# Altium schematic sheet MCU.SchDoc
size A4; SheetNumber: 1; SheetTotal: 4
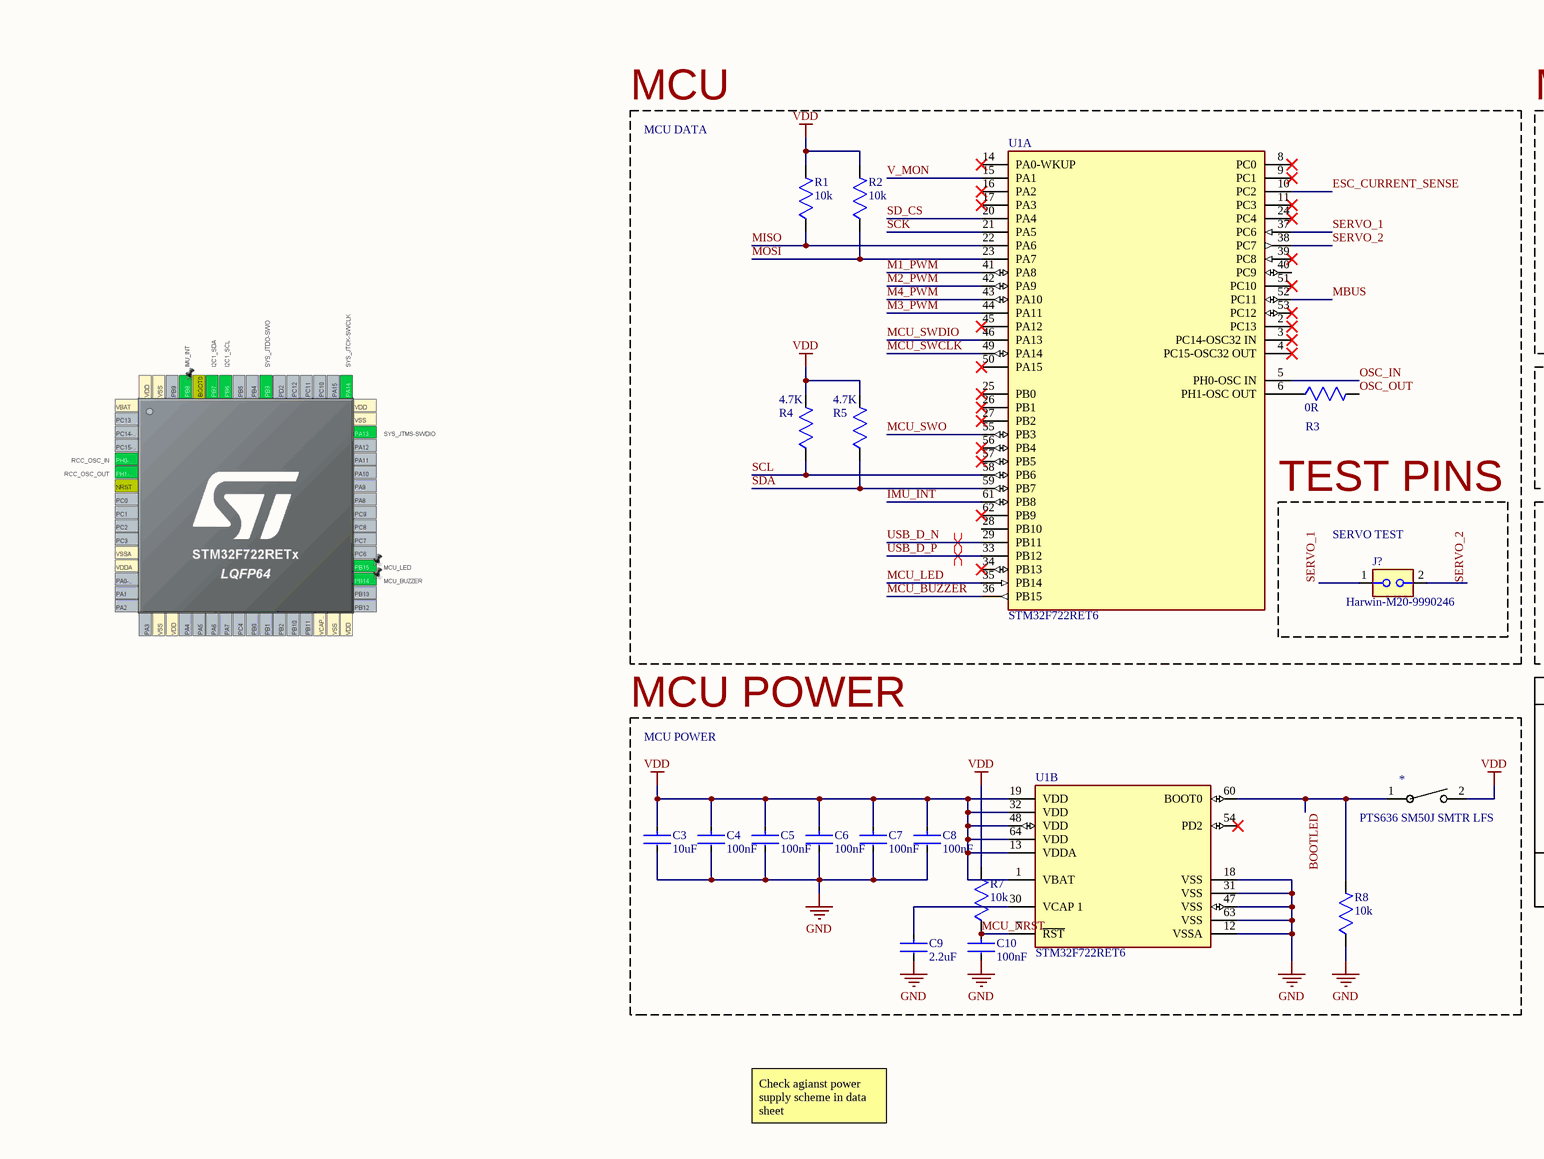
[diagram p0: MCU.SchDoc, left]
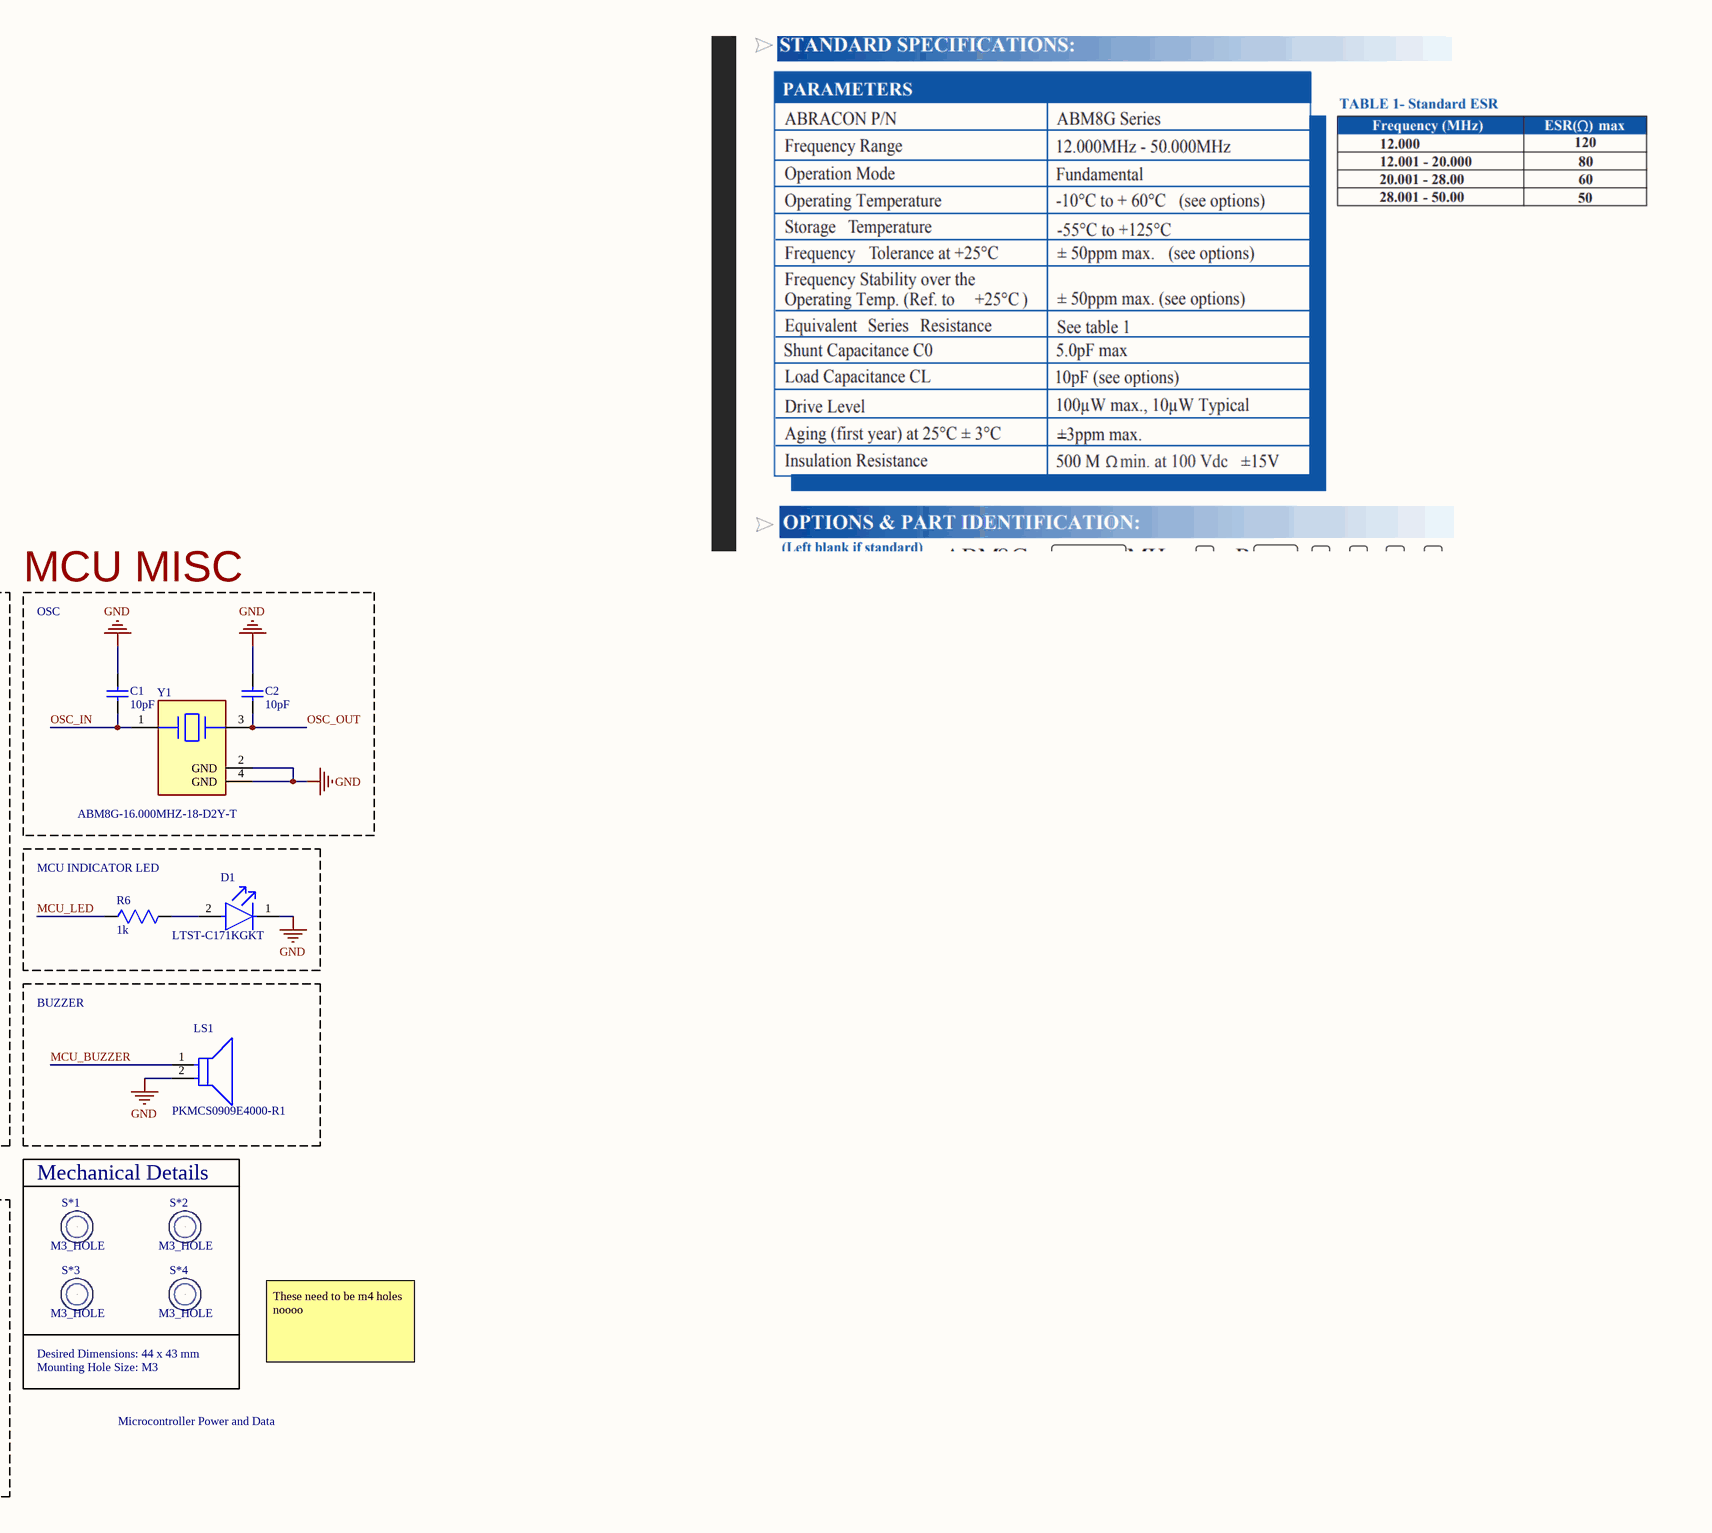
[diagram p1: MCU.SchDoc, right]

## Parts
*  PTS636 SM50J SMTR LFS  [PTS636 SM50J SMTR LFS-Footprint-1]
C1  10pF  [CAPC1005X55X25ML05T05]
C2  10pF  [CAPC1005X55X25ML05T05]
C3  10uF  [CAP_1210]
C4  100nF  [CAP_0603]
C5  100nF  [CAP_0603]
C6  100nF  [CAP_0603]
C7  100nF  [CAP_0603]
C8  100nF  [CAP_0603]
C9  2.2uF  [CAP_1210]
C10  100nF  [CAP_0603]
D1  LTST-C171KGKT  [FP-LTST-C171KGKT-MFG]
J?  Harwin-M20-9990246  [HARWIN_M20-9990246]
LS1  PKMCS0909E4000-R1  [FP-PKMCS-MFG]
R1  10k  [RES_0603]
R2  10k  [RES_0603]
R3  0R  [RES_0603]
R4  4.7K  [RES_0603]
R5  4.7K  [RES_0603]
R6  1k  [RES_0603]
R7  10k  [RES_0603]
R8  10k  [RES_0603]
S*1  M3_HOLE  [M3 Screw Hole Footprint]
S*2  M3_HOLE  [M3 Screw Hole Footprint]
S*3  M3_HOLE  [M3 Screw Hole Footprint]
S*4  M3_HOLE  [M3 Screw Hole Footprint]
U1  STM32F722RET6  [FP-LQFP64-5W-IPC_A]  (parts A,B of 2)
Y1  ABM8G-16.000MHZ-18-D2Y-T  [FP-ABM8G-MFG]

## Blocks framed on the sheet
MCU: R1-R5 U1
MCU MISC: C1 C2 Y1
MCU INDICATOR LED: D1 R6
TEST PINS: J?
BUZZER: LS1
MCU POWER: * C3-C10 R7 R8 U1

## Nets
GND: C1.2 C2.2 C3.2 C4.2 C5.2 C6.2 C7.2 C8.2 C9.2 C10.2 D1.1(C) LS1.2(A) R8.1 U1.12(VSSA) U1.18(VSS) U1.31(VSS) U1.47(VSS) U1.63(VSS) Y1.2(GND) Y1.4(GND)
VDD: *.2 C3.1 C4.1 C5.1 C6.1 C7.1 C8.1 R1.2 R2.2 R4.2 R5.2 R7.2 U1.1(VBAT) U1.13(VDDA) U1.19(VDD) U1.32(VDD) U1.48(VDD) U1.64(VDD)
BOOTLED: *.1 R8.2 U1.60(BOOT0)
ESC_CURRENT_SENSE: U1.10(PC2)
IMU_INT: U1.61(PB8)
M1_PWM: U1.41(PA8)
M2_PWM: U1.42(PA9)
M3_PWM: U1.44(PA11)
M4_PWM: U1.43(PA10)
MBUS: U1.52(PC11)
MCU_BUZZER: LS1.1(C) U1.36(PB15)
MCU_LED: R6.1 U1.35(PB14)
MCU_NRST: C10.1 R7.1 U1.7(~{RST})
MCU_SWCLK: U1.49(PA14)
MCU_SWDIO: U1.46(PA13)
MCU_SWO: U1.55(PB3)
MISO: R1.1 U1.22(PA6)
MOSI: R2.1 U1.23(PA7)
OSC_IN: C1.1 U1.5(PH0-OSC_IN) Y1.1
OSC_OUT: C2.1 R3.2 Y1.3
SCK: U1.21(PA5)
SCL: R4.1 U1.58(PB6)
SD_CS: U1.20(PA4)
SDA: R5.1 U1.59(PB7)
SERVO_1: J?.1 U1.37(PC6)
SERVO_2: J?.2 U1.38(PC7)
USB_D_N: U1.29(PB11)
USB_D_P: U1.33(PB12)
V_MON: U1.15(PA1)
NetC9_1: C9.1 U1.30(VCAP_1)
NetD1_2: D1.2(A) R6.2
NetR3_1: R3.1 U1.6(PH1-OSC_OUT)

Not connected (* = marked no-connect by the designer): S*1 0; S*2 0; S*3 0; S*4 0; U1 2(PC13)* 3(PC14-OSC32_IN)* 4(PC15-OSC32_OUT)* 8(PC0)* 9(PC1)* 11(PC3)* 14(PA0-WKUP)* 16(PA2)* 17(PA3)* 24(PC4)* 25(PB0)* 26(PB1)* 27(PB2)* 28(PB10) 34(PB13)* 39(PC8)* 40(PC9) 45(PA12)* 50(PA15)* 51(PC10)* 53(PC12)* 54(PD2)* 56(PB4)* 57(PB5)* 62(PB9)*

## Layout directives
differential pair: USB_D_N, USB_D_P

## Notes on the sheet
- MCU DATA
- OSC
- (near J?) SERVO TEST
- MCU POWER
- Mechanical Details
- Desired Dimensions: 44 x 43 mm
- These need to be m4 holes noooo
- Mounting Hole Size: M3
- Microcontroller Power and Data
- Check agianst power supply scheme in data sheet

## Library data of the parts
* = CMP-00098-1: Switch Tactile N.O. SPST Rectangular Button J-Bend 0.05A 12VDC 1.77N SMD T/R; Number of Positions: 1; Operating Force: 2.26N; Electrical Life: 50kcycles; Max Voltage Rating (DC): 12V; Max Current Rating: 50mA; Insulation Resistance: 100MΩ; Sealable: IP40; Length: 6mm; Lifecycle Status: Production; Throw Configuration: SPST; Min Operating Temperature: -40°C; Max Operating Temperature: 90°C; RoHS: Compliant; Height: 3.25mm; REACH SVHC: Yes; Contact Resistance: 100mΩ; Color: Black
C1 C2 = CMP-2100-03589-1: Chip Capacitor, 10 pF, +/- 5%, 50 V, -55 to 125 degC, 0402 (1005 Metric), RoHS, Tape and Reel; Manufacturer: Yageo; Insulation Resistance: 100GR; Voltage Rating (DC): 50V; Dielectric Material: Ceramic; Temperature Coefficient: 30ppm/degC; Dielectric: C0G; Termination: SMD/SMT; Package Reference: 0402; Lead Free: LeadFree; Composition: Ceramic; Tolerance: 5%; Case Code (Metric): 1005; Voltage Rating: 50V; Packaging: TapeandReel; Manufacturer URL: http://www.yageo.com/; REACH SVHC: NoSVHC; Max Operating Temperature: 125degC; Length: 1mm; Mount: SurfaceMount; Depth: 0.5mm; Min Operating Temperature: -55degC; Number of Pins: 2; Width: 0.02inch; Datasheet Version: Rev. 14, 07/2016; Package Quantity: 1; Datasheet URL: http://www.yageo.com/documents/recent/UPY-GP_NP0_16V-to-50V_14.pdf; Case Code (Imperial): 0402; RoHSCompliant: True; Radiation Hardening: No; Height: 0.5mm; Case/Package: 0402; Thickness: 0.022inch; Capacitance: 10pF; Package Description: 2-Pin Surface Mount Device, Body 1 x 0.5 mm; Voltage: 50V
C3 = CMP-097-000018-7: 10 µF ±10% 100V Ceramic Capacitor X7S 1210 (3225 Metric); JLCPCB Part No.: C5596909
C4-C8 C10 = CMP-097-000004-12: CAP CER 0.1UF 50V X7R 0603; Tolerance (fill in as +-): 10%; Capacitor Type: Ceramic; Multilayer: Yes; Width: 0.8mm; Pins: 2; Case/Package: 0603; Max Operating Temperature: 125°C; Value: 100nF; Package Style: SMTMeter; Terminal Finish: Nickel; RoHS Compliant: Yes; Height: 0.8mm; Reach SVHC Compliant: Yes; JLCPCB Part No.: C14663; Tolerance  (fill in as +-): 10%; Temperature Characteristics Code: X7R; Rated DC Voltage (URdc): 50V; JESD-609 Code: e3; Termination: Wraparound; Dielectric Material: Ceramic; Length: 1.6mm; Package Shape: Rectangular; Min Operating Temperature: -55°C; Packaging: Tape and Reel; Mounting Technology: Surface Mount
C9 = CMP-097-000020-5: 2.2 µF ±10% 100V Ceramic Capacitor X7R 1210 (3225 Metric); JLCPCB Part No.: C55151; Value: 2.2uF
D1 = CMP-22017-000037-1: LED GREEN CLEAR SMD; Number of LEDs: 1; Viewing Angle: 130°; Lens Style: Rectangular; Dominant Wavelength: 571nm; Test Current: 20mA; Luminous Intensity: 35mcd; Power Rating: 75mW; Forward Voltage: 2.4V; Forward Current: 30mA; Reverse Voltage: 5V; Lens Color: Colorless; Wavelength: 574nm; Height: 0.8mm; Illumination Color: Green; Length: 2mm; Case/Package: 0805; Number of Pins: 2; Number of Elements: 1; Package Quantity: 1; Depth: 1.25mm; Lens Transparency: Clear; Width: 1.25mm; Color: Green; Radiation Hardening: No; Mount: Surface Mount; Packaging: Tape and Reel; Case Code (Metric): 2012; Lead Free: Lead Free; Max Operating Temperature: 85°C; Min Operating Temperature: -55°C; Case Code (Imperial): 0805; Power Dissipation: 75mW
J? = CMP-00000-10: Connector Header Through Hole 2 position 0.100" (2.54mm); Number of Positions: 2; Contact Resistance: 30mR; Voltage Rating (AC): 750V; Max Current Rating: 3A; Insulation Resistance: 10GR; Gender: Male; Case/Package: SIL; Termination: Solder; Mount: Through Hole; Housing Material: Nylon; Max Operating Temperature: 105°C; JLCPCB Part No.: C3332353; Orientation: Straight; Contact Material: Bronze,Brass; Depth: 2.54mm; Current Rating: 3A; Radiation Hardening: No; Pitch: 2.54mm; Reach SVHC Compliant: No; Length: 5.08mm; Number of Rows: 1; Series: M20; Packaging: Bulk; Contact Plating: Tin; Contact Type: Male Pin; Color: Black; Contact Mating Length: 0.24inch; Package Quantity: 1000; Housing Color: Black; Min Operating Temperature: -40°C; Number of Contacts: 2
LS1 = CMP-2000-05252-2: AUDIO PIEZO TRANSDUCER 12.5V SMD; Min Supply Voltage (DC): -12.5V; Self Resonant Frequency: 4kHz; Voltage Rating: 1.5V; Height: 1.9mm; Packaging: Tape and Reel; Min Operating Temperature: -40°C; Width: 9mm; Lead Free: Lead Free; Max Operating Temperature: 85°C; Max Supply Voltage (DC): 12.5V; Termination: Solder; Depth: 9mm; REACH SVHC: No SVHC; Frequency: 4kHz; Voltage Rating (DC): 12.5V; Radiation Hardening: No; Package Quantity: 2000; Length: 9mm; Mount: Surface Mount
R1 R2 R7 R8 = CMP-00013-14: 10 kOhms ±1% 0.1W, 1/10W Chip Resistor 0603 (1608 Metric) Moisture Resistant Thick Film; Package Height: 0.45mm; Rated Temperature: 70°C; Temperature Coefficient: 100ppm/°C; Value: 10kR; Additional Feature: LASER TRIMMABLE; Power: 100mW; Working Voltage: 75V; Package Width: 0.8mm; Package Length: 1.6mm; Technology: METAL GLAZE/THICK FILM; Package Style: SMTMeter; Mounting Technology: Surface Mount; Reach SVHC Compliant: Yes; Package Shape: Rectangular; Min Operating Temperature: -55°C; Construction: Chip; JESD-609 Code: e3; Packaging: Tape and Reel; Tolerance: 1%; Max Operating Temperature: 155°C; Case/Package: 0603; Termination: Wraparound; Resistor Type: FIXED RESISTOR; Terminal Finish: Nickel; Pins: 2; JLCPCB Part No.: C98220; RoHS Compliant: Yes
R3 = CMP-027-000028-7: 0 Ohms Jumper Chip Resistor 0603 (1608 Metric) Moisture Resistant Thick Film; Package Length: 1.6mm; Package Height: 0.45mm; Power: 100mW; Package Width: 0.8mm; Rated Temperature: 70°C; JLCPCB Part No.: C95177; RoHS Compliant: Yes; Packaging: Tape and Reel; Technology: METAL GLAZE/THICK FILM; Max Operating Temperature: 155°C; Pins: 2; Reach SVHC Compliant: Yes; Value: 0R; Package Shape: Rectangular; Min Operating Temperature: -55°C; Terminal Finish: Nickel; Termination: Wraparound; Resistor Type: FIXED RESISTOR; Mounting Technology: Surface Mount; Construction: Chip; Case/Package: 0603; JESD-609 Code: e3
R4 R5 = CMP-00062-2: Res Thick Film 1.6 x 0.8 mm 4.7K Ohm 1% 0.1W(1/10W) 100ppm/ C Molded SMD Paper T/R; JLCPCB Part No.: C99782
R6 = CMP-019-000000-15: 1 kOhms ±1% 0.1W, 1/10W Chip Resistor 0603 (1608 Metric) Moisture Resistant Thick Film; Rated Temperature: 70°C; Working Voltage: 75V; Package Height: 0.45mm; MP: RC0805FR-071KL; Package Length: 1.6mm; Additional Feature: LASER TRIMMABLE; Temperature Coefficient: 100ppm/°C; Power: 100mW; MF: Yageo; Value: 1kR; Package Width: 0.8mm; Availability: In Stock; Package Style: SMTMeter; Termination: Wraparound; Min Operating Temperature: -55°C; SnapEDA_Link: https://www.snapeda.com/parts/RC0805FR-071KL/Yageo/view-part/?ref=snap; Mounting Technology: Surface Mount; Package: 2012 Rohm Semiconductor; JESD-609 Code: e3; Resistor Type: FIXED RESISTOR; Tolerance: 1%; RoHS Compliant: Yes; Case/Package: 0603; Package Shape: Rectangular; Component Type: Standard; Check_prices: https://www.snapeda.com/parts/RC0805FR-071KL/Yageo/view-part/?ref=eda; Pins: 2; Source: RC0805FR-071KL.SchLib; JLCPCB Part No.: C22548; Max Operating Temperature: 155°C; Pin Count: 2; Construction: Chip; Purchase-URL: https://pricing.snapeda.com/search/part/RC0805FR-071KL/?ref=eda; Terminal Finish: Nickel; Technology: METAL GLAZE/THICK FILM; Price: None; Reach SVHC Compliant: Yes; Design Item ID: RC0805FR-071KL; Packaging: Tape and Reel
S*1-S*4 = CMP-00045-5: Standard sized M3 screw mounting hole
U1 = CMP-12105-000139-1: IC MCU 32BIT 512KB FLASH 64LQFP; Interface: I2C; Number of I/Os: 50; Peripherals: Brown-out Detect/Reset; Core Architecture: ARM; Oscillator Type: Internal; Frequency: 216MHz; Memory Size: 512KB; Min Operating Temperature: -40°C; Max Operating Temperature: 85°C; Mount: Surface Mount; Case/Package: LQFP; Memory Type: FLASH; Packaging: Tray
Y1 = CMP-27762-006537-2: Crystal 16MHz ±20ppm (Tol) ±30ppm (Stability) 18pF FUND 80Ω 4-Pin SMD T/R; Series Resistance: 80R; Radiation Hardening: No; Load Capacitance: 18pF; Package Quantity: 1000; Frequency Stability: 30ppm; ESR (Equivalent Series Resistance): 80R; Depth: 2.5mm; Height: 1mm; Number of Pins: 4; Frequency Tolerance: 20ppm; Frequency: 16MHz; Tolerance: 20ppm; Min Operating Temperature: -40°C; Length: 3.2mm; Termination: SMD/SMT; Max Operating Temperature: 85°C; Width: 2.5mm; Series: ABM8G; Mount: Surface Mount; Case/Package: CSMD; Lead Free: Lead Free; Operating Frequency: 16 MHz; Packaging: Tape and Reel